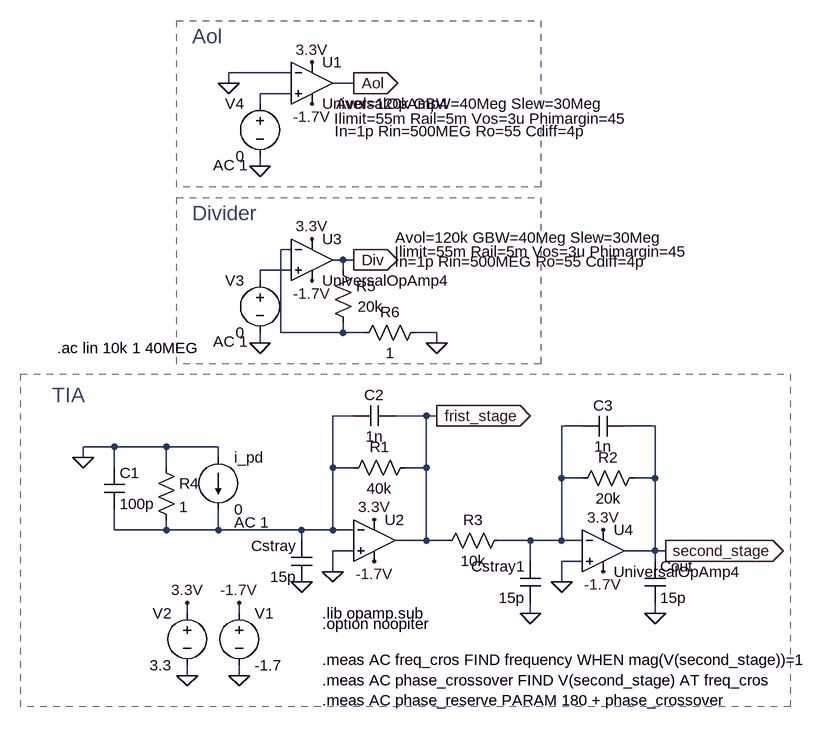
[diagram p0: schematic TIA_photodiode.asc]
TIA_photodiode.asc, the LTspice schematic file:
Version 4.1
SHEET 1 996 680
WIRE 80 -560 -16 -560
WIRE -16 -544 -16 -560
WIRE 176 -544 144 -544
WIRE 80 -528 32 -528
WIRE 32 -512 32 -528
WIRE 32 -416 32 -432
WIRE 80 -288 64 -288
WIRE 160 -272 144 -272
WIRE 176 -272 160 -272
WIRE 80 -256 32 -256
WIRE 160 -256 160 -272
WIRE 32 -240 32 -256
WIRE 64 -160 64 -288
WIRE 160 -160 160 -176
WIRE 160 -160 64 -160
WIRE 192 -160 160 -160
WIRE 304 -160 272 -160
WIRE 32 -144 32 -160
WIRE 304 -144 304 -160
WIRE 176 -32 144 -32
WIRE 288 -32 240 -32
WIRE 304 -32 288 -32
WIRE 528 -16 496 -16
WIRE 640 -16 592 -16
WIRE -192 16 -240 16
WIRE -112 16 -192 16
WIRE -32 16 -112 16
WIRE -240 32 -240 16
WIRE -32 32 -32 16
WIRE -192 48 -192 16
WIRE -112 48 -112 16
WIRE 144 48 144 -32
WIRE 176 48 144 48
WIRE 288 48 288 -32
WIRE 288 48 256 48
WIRE 496 64 496 -16
WIRE 528 64 496 64
WIRE 640 64 640 -16
WIRE 640 64 608 64
WIRE -192 144 -192 112
WIRE -112 144 -112 128
WIRE -112 144 -192 144
WIRE -32 144 -32 112
WIRE -32 144 -112 144
WIRE 96 144 -32 144
WIRE 144 144 144 48
WIRE 144 144 96 144
WIRE 176 144 144 144
WIRE 96 160 96 144
WIRE 288 160 288 48
WIRE 288 160 240 160
WIRE 320 160 288 160
WIRE 448 160 400 160
WIRE 496 160 496 64
WIRE 496 160 448 160
WIRE 528 160 496 160
WIRE 176 176 144 176
WIRE 640 176 640 64
WIRE 640 176 592 176
WIRE 656 176 640 176
WIRE 448 192 448 160
WIRE 528 192 496 192
WIRE 640 192 640 176
WIRE 144 208 144 176
WIRE 496 224 496 192
WIRE -80 272 -80 256
WIRE 0 272 0 256
WIRE 448 272 448 256
WIRE 640 272 640 256
WIRE -80 368 -80 352
WIRE 0 368 0 352
FLAG 0 368 0
FLAG -80 368 0
FLAG -80 256 3.3V
FLAG 0 256 -1.7V
FLAG 208 128 3.3V
FLAG 208 192 -1.7V
FLAG 144 208 0
FLAG 560 144 3.3V
FLAG 560 208 -1.7V
FLAG 496 224 0
FLAG 304 -32 frist_stage
IOPIN 304 -32 Out
FLAG 656 176 second_stage
IOPIN 656 176 Out
FLAG 32 -144 0
FLAG 112 -304 3.3V
FLAG 112 -240 -1.7V
FLAG 176 -272 Div
IOPIN 176 -272 Out
FLAG 96 224 0
FLAG 448 272 0
FLAG 640 272 0
FLAG -240 32 0
FLAG -16 -544 0
FLAG 32 -416 0
FLAG 112 -576 3.3V
FLAG 112 -512 -1.7V
FLAG 176 -544 Aol
IOPIN 176 -544 Out
FLAG 304 -144 0
SYMBOL voltage 0 256 R0
SYMATTR InstName V1
SYMATTR Value -1.7
SYMBOL voltage -80 256 M0
SYMATTR InstName V2
SYMATTR Value 3.3
SYMBOL current -32 32 R0
WINDOW 123 24 100 Left 2
WINDOW 39 24 120 Left 2
SYMATTR Value2 AC 1
SYMATTR InstName i_pd
SYMATTR Value 0
SYMBOL cap 240 -48 R90
WINDOW 0 0 32 VBottom 2
WINDOW 3 32 32 VTop 2
SYMATTR InstName C2
SYMATTR Value 1n
SYMBOL res 272 32 R90
WINDOW 0 0 56 VBottom 2
WINDOW 3 32 56 VTop 2
SYMATTR InstName R1
SYMATTR Value 40k
SYMBOL cap 592 -32 R90
WINDOW 0 0 32 VBottom 2
WINDOW 3 32 32 VTop 2
SYMATTR InstName C3
SYMATTR Value 1n
SYMBOL res 624 48 R90
WINDOW 0 0 56 VBottom 2
WINDOW 3 32 56 VTop 2
SYMATTR InstName R2
SYMATTR Value 20k
SYMBOL res 416 144 R90
WINDOW 0 0 56 VBottom 2
WINDOW 3 32 56 VTop 2
SYMATTR InstName R3
SYMATTR Value 10k
SYMBOL voltage 32 -256 M0
WINDOW 123 19 110 Left 2
WINDOW 39 0 0 Left 0
SYMATTR Value2 AC 1
SYMATTR InstName V3
SYMATTR Value 0
SYMBOL res -128 32 R0
SYMATTR InstName R4
SYMATTR Value 1
SYMBOL cap -208 48 R0
SYMATTR InstName C1
SYMATTR Value 100p
SYMBOL OpAmps\\UniversalOpAmp4 112 -272 R0
WINDOW 123 128 -34 Left 2
WINDOW 39 127 -13 Left 2
WINDOW 40 127 3 Left 2
SYMATTR Value2 Avol=120k GBW=40Meg Slew=30Meg
SYMATTR SpiceLine Ilimit=55m Rail=5m Vos=3u Phimargin=45
SYMATTR SpiceLine2 In=1p Rin=500MEG Ro=55 Cdiff=4p
SYMATTR InstName U3
SYMBOL cap 112 160 M0
SYMATTR InstName Cstray
SYMATTR Value 15p
SYMBOL cap 464 192 M0
SYMATTR InstName Cstray1
SYMATTR Value 15p
SYMBOL cap 624 192 R0
SYMATTR InstName Cout
SYMATTR Value 15p
SYMBOL OpAmps\\UniversalOpAmp4 560 176 R0
SYMATTR Value2 Avol=120k GBW=40Meg Slew=30Meg
SYMATTR SpiceLine Ilimit=55m Rail=5m Vos=3u Phimargin=45
SYMATTR SpiceLine2 In=1p Rin=500MEG Ro=55 Cdiff=4p
SYMATTR InstName U4
SYMBOL OpAmps\\UniversalOpAmp2 208 160 R0
SYMATTR InstName U2
SYMATTR Value2 Avol=110k GBW=40Meg Slew=10Meg
SYMBOL voltage 32 -528 M0
WINDOW 123 19 110 Left 2
WINDOW 39 0 0 Left 0
SYMATTR Value2 AC 1
SYMATTR InstName V4
SYMATTR Value 0
SYMBOL OpAmps\\UniversalOpAmp4 112 -544 R0
WINDOW 123 37 32 Left 2
WINDOW 39 34 55 Left 2
WINDOW 40 35 74 Left 2
SYMATTR Value2 Avol=120k GBW=40Meg Slew=30Meg
SYMATTR SpiceLine Ilimit=55m Rail=5m Vos=3u Phimargin=45
SYMATTR SpiceLine2 In=1p Rin=500MEG Ro=55 Cdiff=4p
SYMATTR InstName U1
SYMBOL res 144 -272 R0
WINDOW 3 38 72 Left 2
SYMATTR Value 20k
SYMATTR InstName R5
SYMBOL res 288 -176 R90
WINDOW 0 0 56 VBottom 2
WINDOW 3 32 56 VTop 2
SYMATTR InstName R6
SYMATTR Value 1
TEXT -280 -136 Left 2 !.ac lin 10k 1 40MEG
TEXT 128 344 Left 2 !.meas AC freq_cros FIND frequency WHEN mag(V(second_stage))=1\n.meas AC phase_crossover FIND V(second_stage) AT freq_cros\n.meas AC phase_reserve PARAM 180 + phase_crossover
TEXT 128 288 Left 2 !.option noopiter
TEXT 128 272 Left 2 !.lib opamp.sub
TEXT -288 -64 Left 3 ;TIA
TEXT -72 -344 Left 3 ;Divider
TEXT -72 -616 Left 3 ;Aol
RECTANGLE Normal 464 -112 -96 -368 2
RECTANGLE Normal 848 416 -336 -96 2
RECTANGLE Normal 464 -384 -96 -640 2

The netlist it stands for:
* TIA_photodiode.asc
V1 -1.7V 0 -1.7
V2 3.3V 0 3.3
i_pd 0 N004 0 AC 1
C2 frist_stage N004 1n
R1 frist_stage N004 40k
C3 second_stage N005 1n
R2 second_stage N005 20k
R3 N005 frist_stage 10k
V3 N003 0 0 AC 1
R4 0 N004 1
C1 0 N004 100p
* U3: UniversalOpAmp4 Avol=120k GBW=40Meg Slew=30Meg Ilimit=55m Rail=5m Vos=3u Phimargin=45 In=1p Rin=500MEG Ro=55 Cdiff=4p (symbol OpAmps\UniversalOpAmp4 not available, pins judged from their places): In+=N003 In-=N002 V+=3.3V V-=-1.7V OUT=Div
Cstray N004 0 15p
Cstray1 N005 0 15p
Cout second_stage 0 15p
* U4: UniversalOpAmp4 Avol=120k GBW=40Meg Slew=30Meg Ilimit=55m Rail=5m Vos=3u Phimargin=45 In=1p Rin=500MEG Ro=55 Cdiff=4p (symbol OpAmps\UniversalOpAmp4 not available, pins judged from their places): In+=0 In-=N005 V+=3.3V V-=-1.7V OUT=second_stage
X§U2 0 N004 3.3V -1.7V frist_stage level2 Avol=110k GBW=40Meg Slew=10Meg Ilimit=25m Rail=0 Vos=0 En=0 Enk=0 In=0 Ink=0 Rin=500Meg  ; pins In+ In- V+ V- OUT
V4 N001 0 0 AC 1
* U1: UniversalOpAmp4 Avol=120k GBW=40Meg Slew=30Meg Ilimit=55m Rail=5m Vos=3u Phimargin=45 In=1p Rin=500MEG Ro=55 Cdiff=4p (symbol OpAmps\UniversalOpAmp4 not available, pins judged from their places): In+=N001 In-=0 V+=3.3V V-=-1.7V OUT=Aol
R5 Div N002 20k
R6 0 N002 1
.ac lin 10k 1 40MEG
.meas AC freq_cros FIND frequency WHEN mag(V(second_stage))=1
.meas AC phase_crossover FIND V(second_stage) AT freq_cros
.meas AC phase_reserve PARAM 180 + phase_crossover
.option noopiter
.lib opamp.sub
* TIA
* Divider
* Aol
.lib UniversalOpAmp2.lib
.backanno
.end